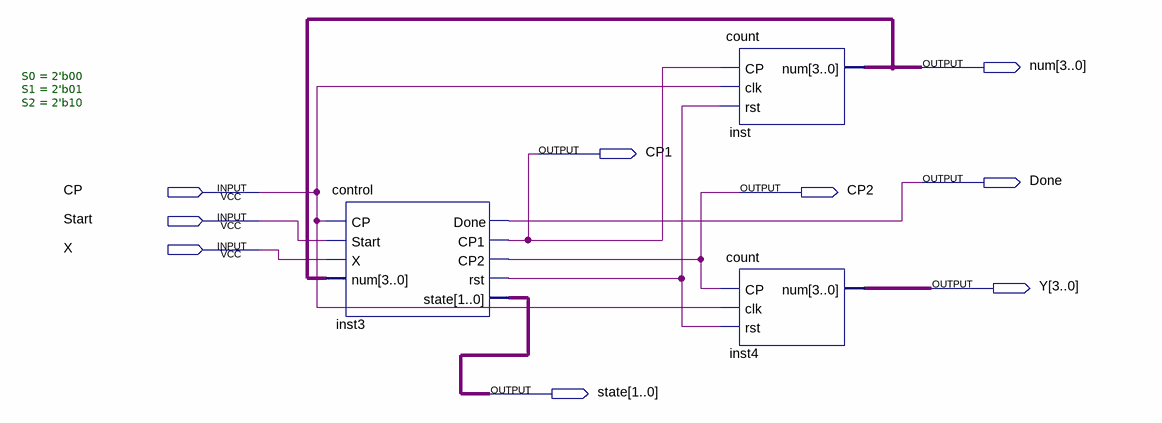
[diagram p0: schematic sheet]
// Quartus schematic demo.bdf as structural Verilog: 3 symbols, 9 pins
module demo (
  input  CP,
  input  Start,
  input  X,
  output [3:0] num,
  output CP1,
  output Done,
  output CP2,
  output [3:0] Y,
  output [1:0] state
);

  wire inst3_rst;

  control #(.S0(2'b00), .S1(2'b01), .S2(2'b10)) inst3 (
    .CP(CP), .Start(Start), .X(X), .num(num), .Done(Done), .CP1(CP1), .CP2(CP2), .rst(inst3_rst),
    .state(state));
  count inst (.CP(CP1), .clk(CP), .rst(inst3_rst), .num(num));
  count inst4 (.CP(CP2), .clk(CP), .rst(inst3_rst), .num(Y));
endmodule
